# Altium schematic sheet AQCA-Light-Control-uC-A1.SchDoc
size A4
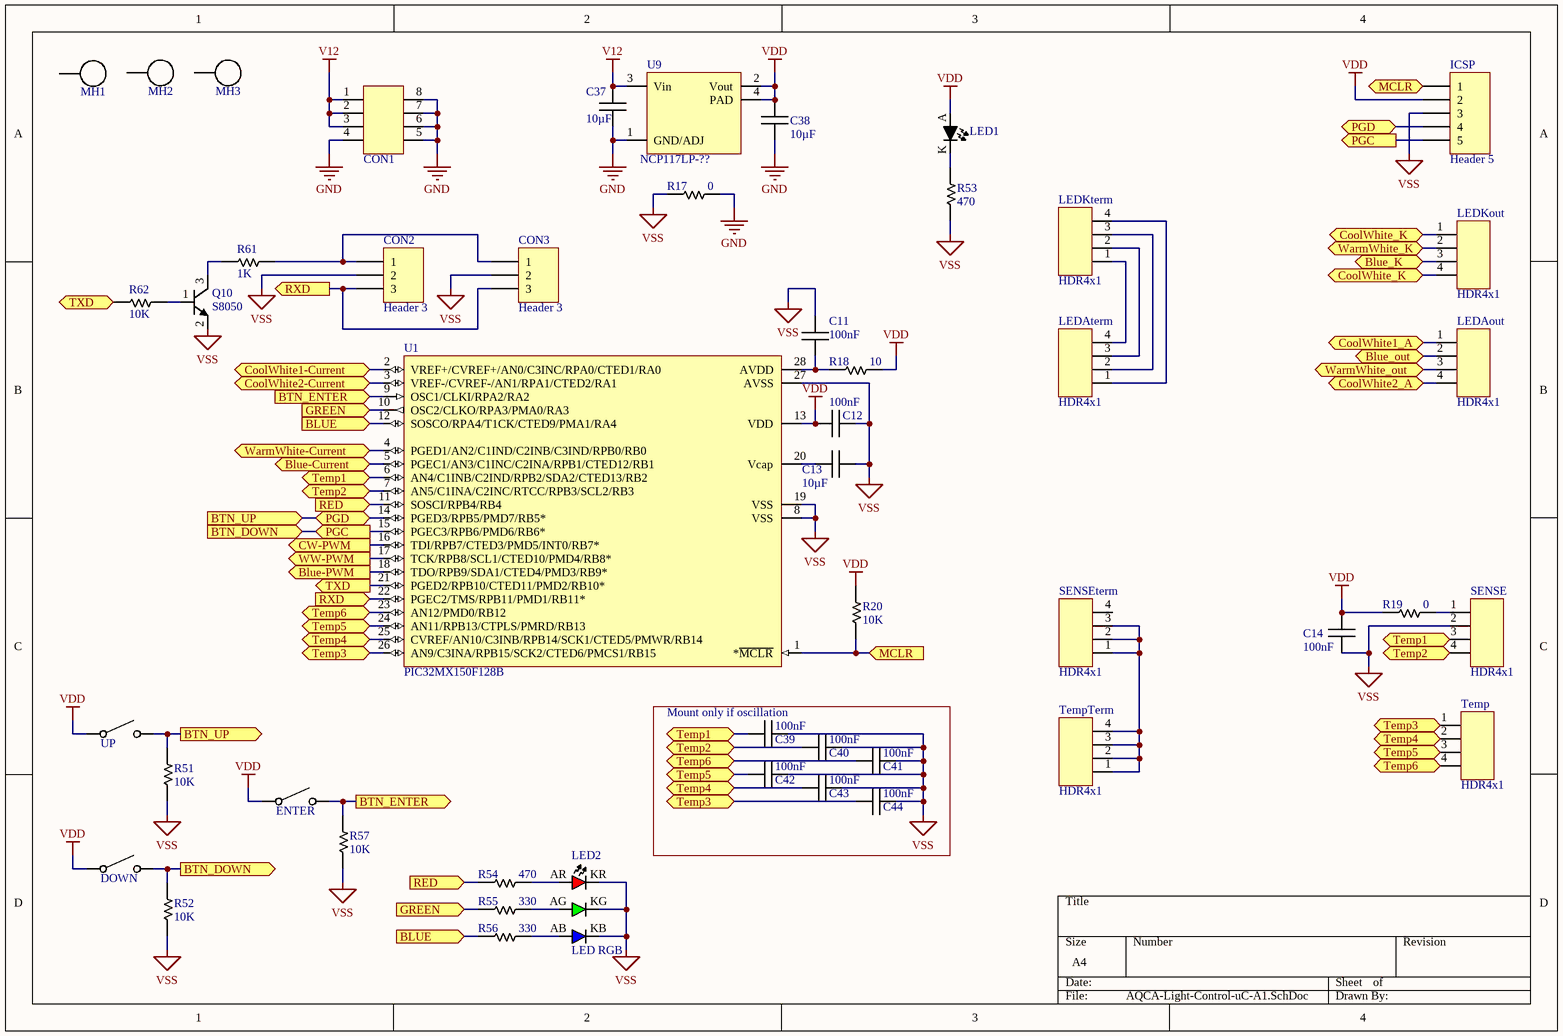
[diagram p0: AQCA-Light-Control-uC-A1.SchDoc]

## Parts
C11  100nF  [CAPC1608N]
C12  100nF  [CAPC1608N]
C13  10µF  [CAPC2012N]
C14  100nF  [CAPC1608N]
C37  10µF  [CAPC3225N]
C38  10µF  [CAPC3225N]
C39  100nF  [CAPC1608N]
C40  100nF  [CAPC1608N]
C41  100nF  [CAPC1608N]
C42  100nF  [CAPC1608N]
C43  100nF  [CAPC1608N]
C44  100nF  [CAPC1608N]
CON1  Molex Mini-Fit 8pin  [Molex Mini-Fit 8pin]  (value not drawn)
CON2  Header 3  [HDR1X3]
CON3  Header 3  [HDR1X3]
DOWN  Tact Button NO  [TACT SMD 4.5×4.5mm]  (value not drawn)
ENTER  Tact Button NO  [TACT SMD 4.5×4.5mm]  (value not drawn)
ICSP  Header 5  [HDR1X5]
LED1  (no value)  [LED 3216m]
LED2  LED RGB  [LED PLCC-6]
LEDAout  HDR4x1  [HDR4x1 EDGE female]
LEDAterm  HDR4x1  [HDR4x1 EDGE male]
LEDKout  HDR4x1  [HDR4x1 EDGE female]
LEDKterm  HDR4x1  [HDR4x1 EDGE male]
MH1  Mounting Hole  [Mount Hole 4-6.5]  (value not drawn)
MH2  Mounting Hole  [Mount Hole 4-6.5]  (value not drawn)
MH3  Mounting Hole  [Mount Hole 4-6.5]  (value not drawn)
Q10  S8050  [SOT23_N]
R17  0  [RESC1608N]
R18  10  [RESC1608N]
R19  0  [RESC1608N]
R20  10K  [RESC1608N]
R51  10K  [RESC1608N]
R52  10K  [RESC1608N]
R53  470  [RESC1608N]
R54  470  [RESC1608N]
R55  330  [RESC1608N]
R56  330  [RESC1608N]
R57  10K  [RESC1608N]
R61  1K  [RESC1608N]
R62  10K  [RESC1608N]
SENSE  HDR4x1  [HDR4x1 EDGE female]
SENSEterm  HDR4x1  [HDR4x1 EDGE male]
Temp  HDR4x1  [HDR4x1 EDGE female]
TempTerm  HDR4x1  [HDR4x1 EDGE male]
U1  PIC32MX150F128B  [SSOP28_N]
U9  NCP117LP-??  [SOT223-4N]
UP  Tact Button NO  [TACT SMD 4.5×4.5mm]  (value not drawn)

## Blocks framed on the sheet
Mount only if oscillation: C39-C44

## Ports
BLUE (in), Blue-Current, Blue-PWM (out), Blue_K, Blue_out, BTN_DOWN (in), BTN_DOWN (out), BTN_ENTER (in), BTN_ENTER (out), BTN_UP (in), BTN_UP (out), CoolWhite1-Current, CoolWhite1_A, CoolWhite2-Current, CoolWhite2_A, CoolWhite_K, CW-PWM (out), GREEN (in), MCLR (in), MCLR (out), PGC (in), PGC (out), PGD (bidir), RED (in), RXD (in), RXD (out), Temp1, Temp2, Temp3, Temp4, Temp5, Temp6, TXD (in), TXD (out), WarmWhite-Current, WarmWhite_K, WarmWhite_out, WW-PWM (out)

## Nets
GND: C37.1 C38.1 CON1.4 CON1.5 CON1.6 CON1.7 CON1.8 R17.2 U9.1(GND/ADJ)
V12: C37.2 CON1.1 CON1.2 CON1.3 U9.3(Vin)
VDD: C12.1 C14.2 C38.2 DOWN.1 ENTER.1 ICSP.2 LED1.A R18.2 R19.1 R20.2 U1.13(VDD) U9.2(Vout) U9.4(PAD) UP.1
VSS: C11.2 C12.2 C13.2 C14.1 C39.2 C40.2 C41.2 C42.2 C43.2 C44.2 CON2.2 CON3.2 ICSP.3 LED2.KB LED2.KG LED2.KR Q10.2(E) R17.1 R51.1 R52.1 R53.1 R57.1 SENSE.2 U1.8(VSS) U1.19(VSS) U1.27(AVSS)
BLUE: R56.1 U1.12(SOSCO/RPA4/T1CK/CTED9/PMA1/RA4) ; port BLUE
Blue-Current: U1.5(PGEC1/AN3/C1INC/C2INA/RPB1/CTED12/RB1) ; port Blue-Current
Blue-PWM: U1.18(TDO/RPB9/SDA1/CTED4/PMD3/RB9*) ; port Blue-PWM
Blue_K: LEDKout.3 ; port Blue_K
Blue_out: LEDAout.2 ; port Blue_out
BTN_DOWN: DOWN.2 ICSP.5 R52.2 U1.15(PGEC3/RPB6/PMD6/RB6*) ; port PGC, port BTN_DOWN
BTN_ENTER: ENTER.2 R57.2 U1.9(OSC1/CLKI/RPA2/RA2) ; port BTN_ENTER
BTN_UP: ICSP.4 R51.2 U1.14(PGED3/RPB5/PMD7/RB5*) UP.2 ; port PGD, port BTN_UP
CoolWhite1-Current: U1.2(VREF+/CVREF+/AN0/C3INC/RPA0/CTED1/RA0) ; port CoolWhite1-Current
CoolWhite1_A: LEDAout.1 ; port CoolWhite1_A
CoolWhite2-Current: U1.3(VREF-/CVREF-/AN1/RPA1/CTED2/RA1) ; port CoolWhite2-Current
CoolWhite2_A: LEDAout.4 ; port CoolWhite2_A
CoolWhite_K: LEDKout.1 LEDKout.4 ; port CoolWhite_K
CW-PWM: U1.16(TDI/RPB7/CTED3/PMD5/INT0/RB7*) ; port CW-PWM
GREEN: R55.1 U1.10(OSC2/CLKO/RPA3/PMA0/RA3) ; port GREEN
MCLR: ICSP.1 R20.1 U1.1(*~{MCLR}) ; port MCLR
RED: R54.1 U1.11(SOSCI/RPB4/RB4) ; port RED
RXD: CON2.3 CON3.3 U1.22(PGEC2/TMS/RPB11/PMD1/RB11*) ; port RXD
Temp1: C39.1 SENSE.3 U1.6(AN4/C1INB/C2IND/RPB2/SDA2/CTED13/RB2) ; port Temp1
Temp2: C40.1 SENSE.4 U1.7(AN5/C1INA/C2INC/RTCC/RPB3/SCL2/RB3) ; port Temp2
Temp3: C44.1 Temp.1 U1.26(AN9/C3INA/RPB15/SCK2/CTED6/PMCS1/RB15) ; port Temp3
Temp4: C43.1 Temp.2 U1.25(CVREF/AN10/C3INB/RPB14/SCK1/CTED5/PMWR/RB14) ; port Temp4
Temp5: C42.1 Temp.3 U1.24(AN11/RPB13/CTPLS/PMRD/RB13) ; port Temp5
Temp6: C41.1 Temp.4 U1.23(AN12/PMD0/RB12) ; port Temp6
TXD: R62.1 U1.21(PGED2/RPB10/CTED11/PMD2/RB10*) ; port TXD
WarmWhite-Current: U1.4(PGED1/AN2/C1IND/C2INB/C3IND/RPB0/RB0) ; port WarmWhite-Current
WarmWhite_K: LEDKout.2 ; port WarmWhite_K
WarmWhite_out: LEDAout.3 ; port WarmWhite_out
WW-PWM: U1.17(TCK/RPB8/SCL1/CTED10/PMD4/RB8*) ; port WW-PWM
NetC11_1: C11.1 R18.1 U1.28(AVDD)
NetC13_1: C13.1 U1.20(Vcap)
NetCON2_1: CON2.1 CON3.1 R61.2
NetLED1_K: LED1.K R53.2
NetLED2_AB: LED2.AB R56.2
NetLED2_AG: LED2.AG R55.2
NetLED2_AR: LED2.AR R54.2
NetLEDAterm_1: LEDAterm.1 LEDKterm.4
NetLEDAterm_2: LEDAterm.2 LEDKterm.3
NetLEDAterm_3: LEDAterm.3 LEDKterm.2
NetLEDAterm_4: LEDAterm.4 LEDKterm.1
NetQ10_1: Q10.1(B) R62.2
NetQ10_3: Q10.3(C) R61.1
NetR19_2: R19.2 SENSE.1
NetSENSEterm_1: SENSEterm.1 SENSEterm.2 SENSEterm.3 TempTerm.1 TempTerm.2 TempTerm.3 TempTerm.4

Not connected (* = marked no-connect by the designer): MH1 1; MH2 1; MH3 1; SENSEterm 4

## Library data of the parts
C11-C14 C39-C44 = Capacitor: Voltage: 16V
  C11 C12 C14 C39-C44: Value: 100nF
  C13: Value: 10µF
C37 C38 = Capacitor: Voltage: 25V; Value: 10µF
CON2 CON3 = Header 3: Header, 3-Pin; LatestRevisionDate: 17-Jul-2002; LatestRevisionNote: Re-released for DXP Platform.; Publisher: Altium Limited
DOWN ENTER UP = Tact Button NO: pin to pad: 2>4
ICSP = Header 5: Header, 5-Pin; LatestRevisionDate: 17-Jul-2002; LatestRevisionNote: Re-released for DXP Platform.; Publisher: Altium Limited
LED1 = LED
LED2 = LED RGB: pin to pad: AB>6 AG>2 AR>4 KB>5 KG>1 KR>3
Q10 = NPN: pin to pad: 1>3 3>1; Model: S8050
R17-R20 R51-R57 R61 R62 = Resistor
  R17 R19: Value: 0
  R18: Value: 10
  R20 R51 R52 R57 R62: Value: 10K
  R53 R54: Value: 470
  R55 R56: Value: 330
  R61: Value: 1K
U1 = PIC32MX120FxxxB
U9 = NCP1117LP: Vin: 3.3V; Vout: 18V; Iout: 1A